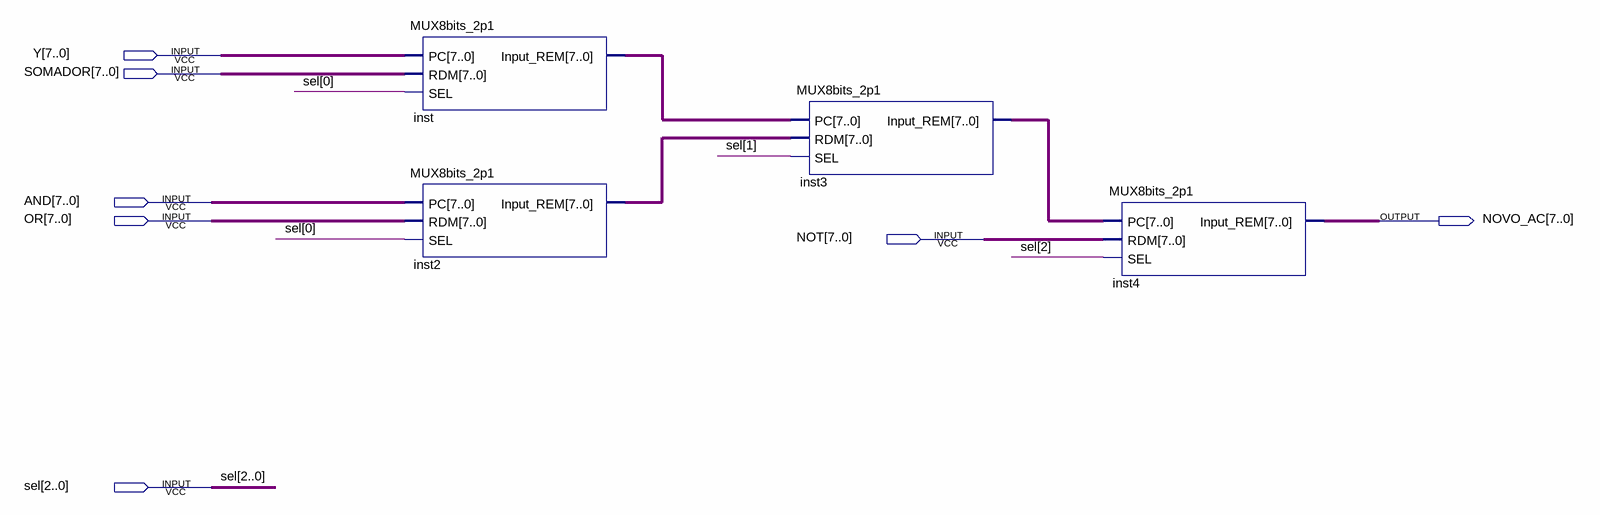
[diagram p0: schematic sheet]
// Quartus schematic MUX_ULA.bdf as structural Verilog: 4 symbols, 7 pins
module MUX_ULA (
  input  [7:0] Y,
  input  [7:0] SOMADOR,
  input  [7:0] AND,
  input  [7:0] OR,
  input  [7:0] NOT,
  input  [2:0] sel,
  output [7:0] NOVO_AC
);

  wire [7:0] inst2_input_rem, inst3_input_rem, inst_input_rem;

  MUX8bits_2p1 inst (.PC(Y), .RDM(SOMADOR), .SEL(sel[0]), .Input_REM(inst_input_rem));
  MUX8bits_2p1 inst2 (.PC(AND), .RDM(OR), .SEL(sel[0]), .Input_REM(inst2_input_rem));
  MUX8bits_2p1 inst3 (.PC(inst_input_rem), .RDM(inst2_input_rem), .SEL(sel[1]), .Input_REM(inst3_input_rem));
  MUX8bits_2p1 inst4 (.PC(inst3_input_rem), .RDM(NOT), .SEL(sel[2]), .Input_REM(NOVO_AC));
endmodule
